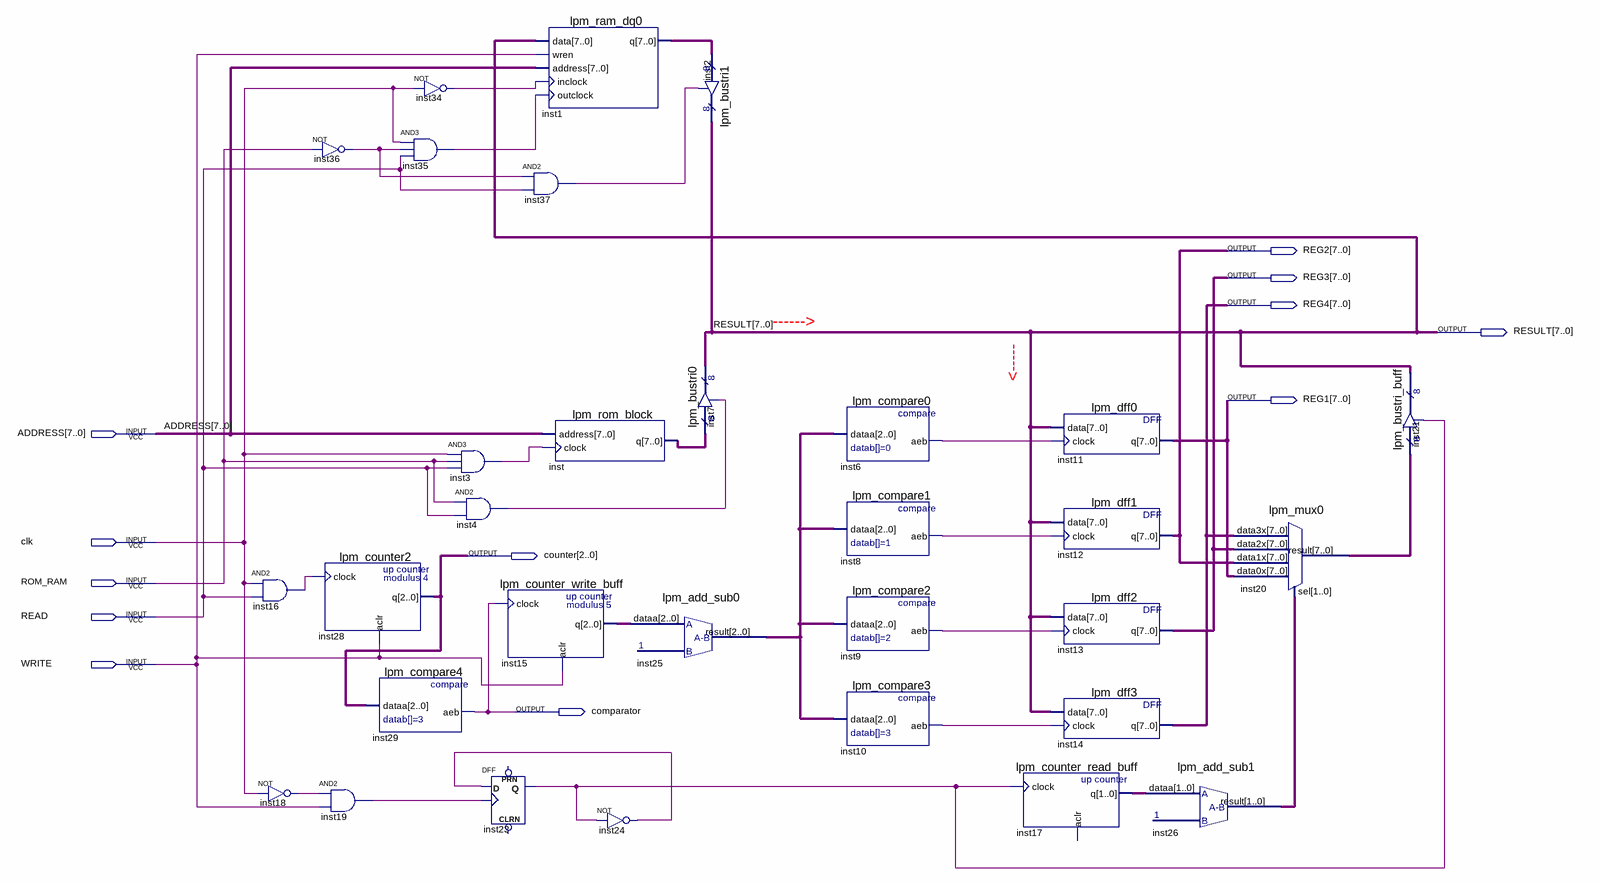
[diagram p0: schematic sheet]
// Quartus schematic SIFO_3_1.bdf as structural Verilog: 31 symbols, 12 pins
module SIFO_3_1 (
  input  [7:0] ADDRESS,
  input  clk,
  input  ROM_RAM,
  input  READ,
  input  WRITE,
  output [7:0] REG2,
  output [7:0] REG3,
  output [7:0] REG4,
  output [7:0] RESULT,
  output [7:0] REG1,
  output [2:0] counter,
  output comparator
);

  wire inst3_out, inst4_out, inst6_aeb, inst8_aeb, inst9_aeb, inst10_aeb, inst16_out, inst18_out, inst19_out,
       inst23_q, inst24_out, inst34_out, inst35_out, inst36_out, inst37_out;
  wire [1:0] inst17_q, inst26_result;
  wire [2:0] inst15_q, inst25_result;
  wire [7:0] inst1_q, inst20_result, inst_q;

  and inst16 (inst16_out, clk, READ);
  not inst18 (inst18_out, clk);
  not inst36 (inst36_out, ROM_RAM);
  lpm_counter2 inst28 (.clock(inst16_out), .aclr(WRITE), .q(counter));
  and inst19 (inst19_out, inst18_out, WRITE);
  and inst35 (inst35_out, clk, inst36_out, READ);
  lpm_compare4 inst29 (.dataa(counter), .aeb(comparator));
  not inst34 (inst34_out, clk);
  and inst3 (inst3_out, clk, ROM_RAM, READ);
  and inst4 (inst4_out, ROM_RAM, READ);
  lpm_counter_write_buff inst15 (.clock(comparator), .aclr(WRITE), .q(inst15_q));
  DFF inst23 (.CLK(inst19_out), .D(inst24_out), .Q(inst23_q));  // open: CLRN, PRN
  lpm_ram_dq0 inst1 (
    .data(RESULT), .wren(WRITE), .address(ADDRESS), .inclock(inst34_out), .outclock(inst35_out), .q(inst1_q));
  and inst37 (inst37_out, inst36_out, READ);
  lpm_rom_block inst (.address(ADDRESS), .clock(inst3_out), .q(inst_q));
  not inst24 (inst24_out, inst23_q);
  lpm_add_sub0 inst25 (.dataa(inst15_q), .result(inst25_result));
  lpm_bustri1 inst2 (.enabledt(inst37_out), .data(inst1_q), .tridata(RESULT));
  lpm_bustri0 inst7 (.enabledt(inst4_out), .data(inst_q), .tridata(RESULT));
  lpm_compare0 inst6 (.dataa(inst25_result), .aeb(inst6_aeb));
  lpm_compare1 inst8 (.dataa(inst25_result), .aeb(inst8_aeb));
  lpm_compare2 inst9 (.dataa(inst25_result), .aeb(inst9_aeb));
  lpm_compare3 inst10 (.dataa(inst25_result), .aeb(inst10_aeb));
  lpm_dff0 inst11 (.data(RESULT), .clock(inst6_aeb), .q(REG1));
  lpm_dff1 inst12 (.data(RESULT), .clock(inst8_aeb), .q(REG2));
  lpm_dff2 inst13 (.data(RESULT), .clock(inst9_aeb), .q(REG3));
  lpm_dff3 inst14 (.data(RESULT), .clock(inst10_aeb), .q(REG4));
  lpm_counter_read_buff inst17 (.clock(inst23_q), .q(inst17_q));  // open: aclr
  lpm_add_sub1 inst26 (.dataa(inst17_q), .result(inst26_result));
  lpm_mux0 inst20 (
    .data3x(REG4), .data2x(REG3), .data1x(REG2), .data0x(REG1), .sel(inst26_result), .result(inst20_result));
  lpm_bustri_buff inst21 (.enabledt(inst23_q), .data(inst20_result), .tridata(RESULT));

  // Notes on the sheet:
  //   ------>
  //   <-----
endmodule
